# EAGLE design ASD2205 (EAGLE 9.6.2)
DATABASE: ./../../../../../Components/TinyCircuits_Part_Database.txt
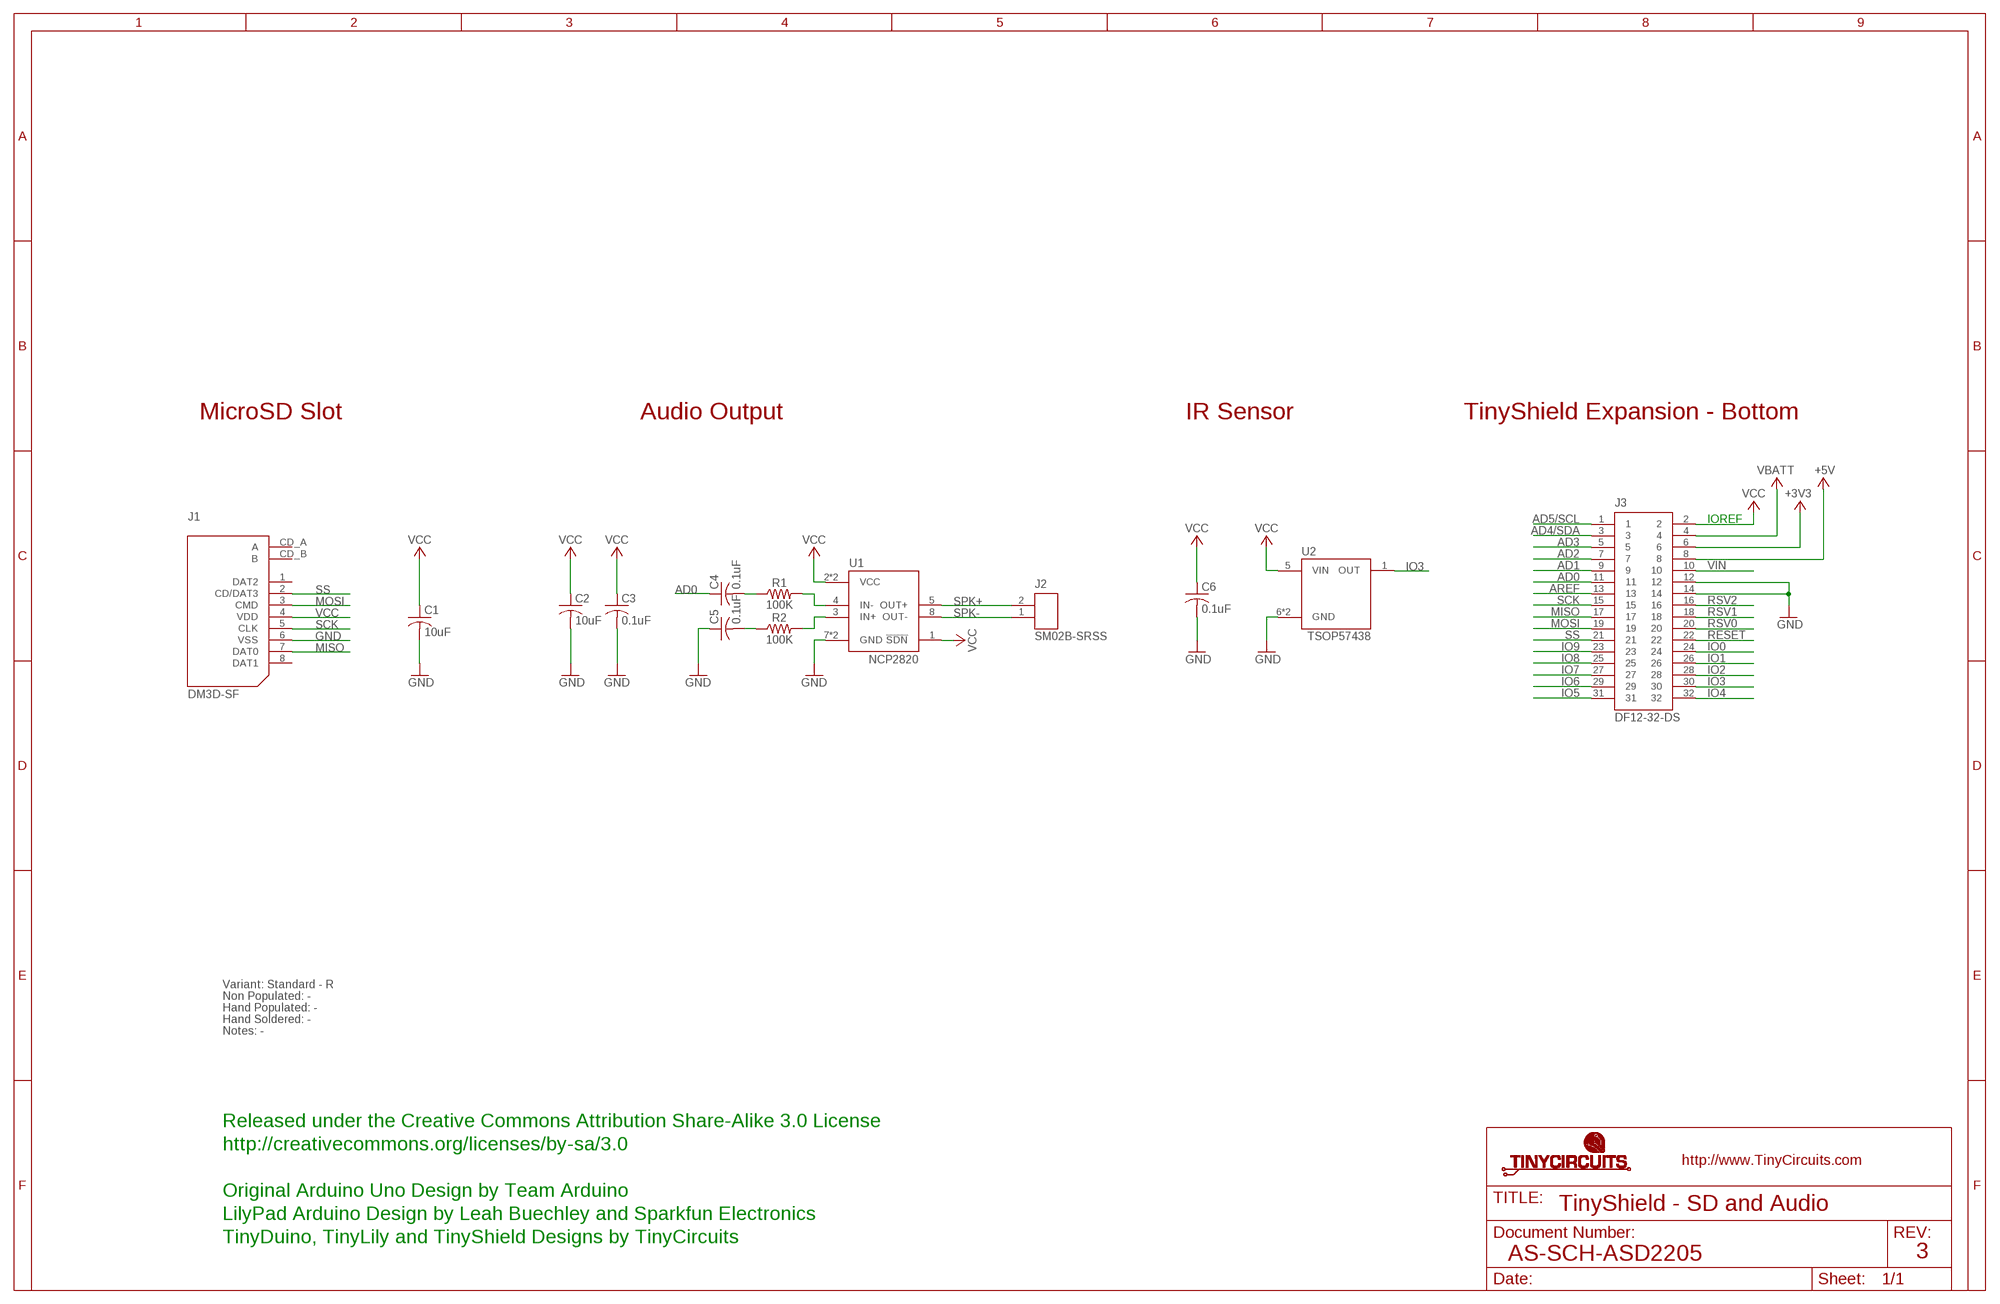
[diagram p0: schematic, sheet 1]

## Parts
C1  10uF  AS-ITM-00002  [C0603]
C2  10uF  AS-ITM-00002  [C0603]
C3  0.1uF  AS-ITM-00008  [C0402]
C4  0.1uF  AS-ITM-00008  [C0402]
C5  0.1uF  AS-ITM-00008  [C0402]
C6  0.1uF  AS-ITM-00008  [C0402]
J1  DM3D-SF  AS-ITM-00047  [SD_CARD]
J2  SM02B-SRSS  AS-ITM-00231  [JST_SH_2X1]
J3  DF12-32-DS  AS-ITM-00012  [DF12-32-DS]
R1  100K  AS-ITM-00004  [0402]
R2  100K  AS-ITM-00004  [0402]
U1  NCP2820  AS-ITM-00370  [WSON-8]
U2  TSOP57438  AS-ITM-00360  [TSOP57]

## Nets
+3V3: J3.6
+5V: J3.8
AD0: C4.1 J3.11
AD1: J3.9
AD2: J3.7
AD3: J3.5
AD4/SDA: J3.3
AD5/SCL: J3.1
AREF: J3.13
GND: C1.2 C2.2 C3.2 C5.1 C6.2 J1.6(VSS) J3.12 J3.14 U1.7(GND) U1.9(GND) U2.6(GND) U2.8(GND)
IO0: J3.24
IO1: J3.26
IO2: J3.28
IO3: J3.30 U2.1(OUT)
IO4: J3.32
IO5: J3.31
IO6: J3.29
IO7: J3.27
IO8: J3.25
IO9: J3.23
MISO: J1.7(DAT0) J3.17
MOSI: J1.3(CMD) J3.19
N$3: R1.2 U1.4(IN-)
N$4: R2.2 U1.3(IN+)
N$11: C4.2 R1.1
N$12: C5.2 R2.1
RESET: J3.22
RSV0: J3.20
RSV1: J3.18
RSV2: J3.16
SCK: J1.5(CLK) J3.15
SPK+: J2.2 U1.5(OUT+)
SPK-: J2.1 U1.8(OUT-)
SS: J1.2(CD/DAT3) J3.21
VBATT: J3.4
VCC: C1.1 C2.1 C3.1 C6.1 J1.4(VDD) J3.2 U1.1(!SDN) U1.2(VCC) U1.6(VCC) U2.5(VIN)
VIN: J3.10
Unconnected: J1.1(DAT2) J1.8(DAT1) J1.CD_A(A) J1.CD_B(B)

## Notes on the sheet
- MicroSD Slot | Audio Output | IR Sensor | TinyShield Expansion - Bottom
- IOREF
- Variant: Standard - R
- Non Populated: -
- Hand Populated: -
- Hand Soldered: -
- Notes: -
- Released under the Creative Commons Attribution Share-Alike 3.0 License
- http://creativecommons.org/licenses/by-sa/3.0
- Original Arduino Uno Design by Team Arduino
- TinyShield - SD and Audio
- LilyPad Arduino Design by Leah Buechley and Sparkfun Electronics
- TinyDuino, TinyLily and TinyShield Designs by TinyCircuits
- AS-SCH-ASD2205 | 3

## Library data of the parts
C1 C2 = tinycircuits:AS-ITM-00002: CAP CER 10UF 10V 20% X5R 0603; PARTNO: AS-ITM-00002
C3-C6 = tinycircuits:AS-ITM-00008: CAP CER 0.1UF 16V 10% X5R 0402; PARTNO: AS-ITM-00008
J1 = tinycircuits:AS-ITM-00047: CONN MICRO SD R/A PUSH-PULL SMD; PARTNO: AS-ITM-00047; PNPROTATION: 270
J2 = tinycircuits:AS-ITM-00231: CONN HEADER SH 2POS SIDE 1MM; PARTNO: AS-ITM-00231; PNPROTATION: 180; VALUE: SM02B-SRSS-TB(LF)(SN)
J3 = tinycircuits:AS-ITM-00012: CONN RECEPT 32POS 3MM SMD 0.5MM; PARTNO: AS-ITM-00012; PNPROTATION: 0
R1 R2 = tinycircuits:AS-ITM-00004: RES 100K OHM 1/16W 1% 0402; PARTNO: AS-ITM-00004
U1 = tinycircuits:AS-ITM-00370: IC PWR AMP AUD 2.65W D 8UDFN; PARTNO: AS-ITM-00370; PNPROTATION: 90
U2 = tinycircuits:AS-ITM-00360: IC IR RCVR MOD 38KHZ; PARTNO: AS-ITM-00360

## Board
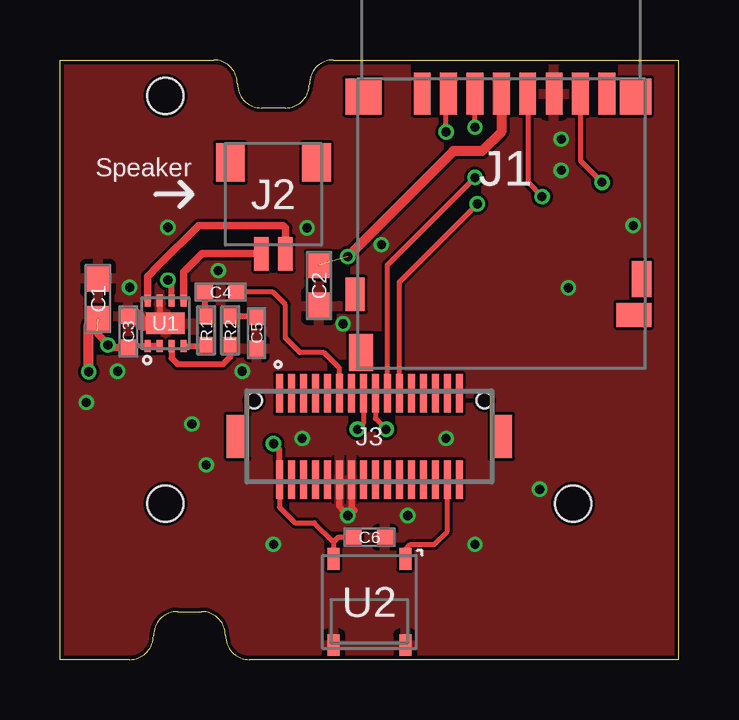
[diagram p1: board, top side]
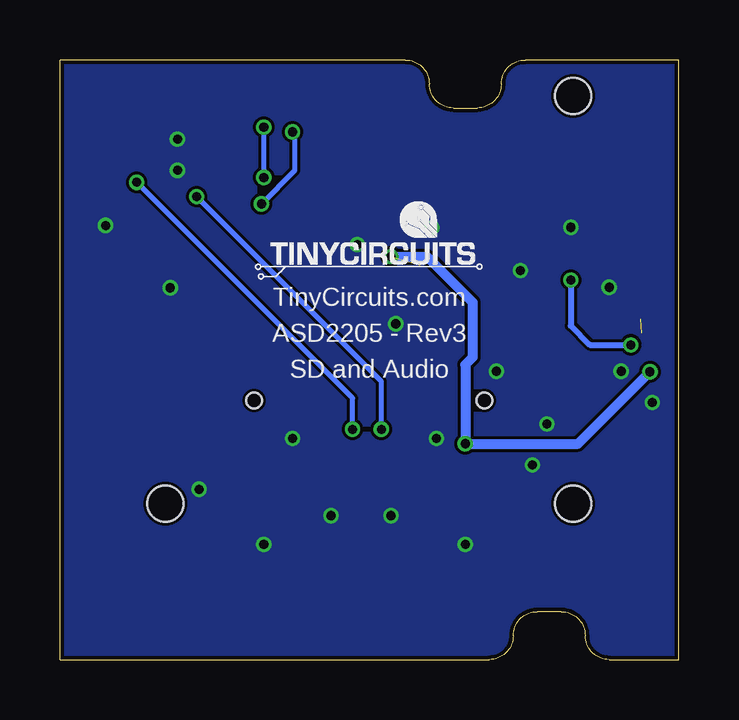
[diagram p2: board, bottom side, seen from below]

Size 25.8 x 25 mm. Coordinates in mm from the lower left corner, seen from the top.
Outline: 0,25 6.4,25 arc-90 7.4,24 arc90 8.4,23 9.4,23 arc90 10.4,24 arc-90 11.4,25 25.8,25 25.8,0 7.9,0 arc-90 6.9,1 arc90 5.9,2 4.9,2 arc90 3.9,1 arc-90 2.9,0 0,0 0,25
Copper layers (1*16): Top 0.035mm / dielectric 1.5mm / Bottom 0.035mm
Design rules "default *": minimum track width 8mil, minimum drill 15mil, track to track 5mil, track to pad 5mil, pad to pad 5mil, via to via 6mil, smd to smd 5mil, copper to edge 6mil, drill to drill 8mil, minimum pad ring 10mil, minimum via ring 5mil, stop-mask expansion 4mil, vias tented up to drill 25mil, thermal gap 10mil
Holes 1.5 mm at 4.4,23.5 21.4,6.5 4.4,6.5

### Footprints (pad centres in the part's own frame; a part is rotated, then mirrored left to right if it is on the bottom)
C0603 = smd 1.1 x 1: 1 -0.85,0; 2 0.85,0
C0402 = smd 0.65 x 0.6: 1 -0.65,0; 2 0.65,0
SD_CARD = smd 0.7 x 1.75: 1 3.3,0; 2 2.2,0; 3 1.1,0; 4 0,0; 5 -1.1,0; 6 -2.2,0; 7 -3.3,0; 8 -4.4,0 | smd 1.3 x 1.5: 9 -5.6,0.125 | smd 1.5 x 1.5: 10 5.75,0.125 | smd 0.8 x 1.5: 11 -5.85,7.725 | smd 0.8 x 1.4: 13 6.1,8.375 | smd 1 x 1.55: CD_A 5.85,10.8 | smd 1.45 x 1: CD_B -5.525,9.225
JST_SH_2X1 = smd 0.6 x 1.4: 1 -0.5,2.475; 2 0.5,2.475 | smd 1.2 x 1.6: PAD1 -1.8,-1.325; PAD2 1.8,-1.325
DF12-32-DS = smd 0.3 x 1.6: 1 -3.75,1.8; 2 -3.75,-1.8; 3 -3.25,1.8; 4 -3.25,-1.8; 5 -2.75,1.8; 6 -2.75,-1.8; 7 -2.25,1.8; 8 -2.25,-1.8; 9 -1.75,1.8; 10 -1.75,-1.8; 11 -1.25,1.8; 12 -1.25,-1.8; 13 -0.75,1.8; 14 -0.75,-1.8; 15 -0.25,1.8; 16 -0.25,-1.8; 17 0.25,1.8; 18 0.25,-1.8; 19 0.75,1.8; 20 0.75,-1.8; 21 1.25,1.8; 22 1.25,-1.8; 23 1.75,1.8; 24 1.75,-1.8; 25 2.25,1.8; 26 2.25,-1.8; 27 2.75,1.8; 28 2.75,-1.8; 29 3.25,1.8; 30 3.25,-1.8; 31 3.75,1.8; 32 3.75,-1.8 | smd 0.9 x 1.8: F1 -5.5,0; F2 5.5,0 | hole 0.65: -4.8,1.5; 4.8,1.5
0402 = smd 0.65 x 0.55: 1 -0.6,0; 2 0.6,0
WSON-8 = smd 0.25 x 0.5: 1 -0.75,-0.95; 2 -0.25,-0.95; 3 0.25,-0.95; 4 0.75,-0.95; 5 0.75,0.95; 6 0.25,0.95; 7 -0.25,0.95; 8 -0.75,0.95 | smd 1.6 x 0.9: 9 0,0
TSOP57 = smd 0.5 x 0.9: 1 -1.5,-1.8; 5 1.5,-1.8; 6 1.5,1.8; 8 -1.5,1.8

### Placement (x,y rotation side)
C1  1.59,15.05 90 top
C2  10.8,15.6 270 top
C3  2.85,13.67 90 top
C4  6.7,15.32 180 top
C5  8.2,13.62 90 top
C6  12.9,5.1 0 top
J1  18.4,23.6 180 top
J2  8.9,19.4 180 top
J3  12.9,9.3 0 top
R1  6.1,13.72 270 top
R2  7.1,13.72 270 top
U1  4.4,14.02 0 top
U2  12.9,2.4 180 top
U$1  [DOCFIELD-TINYCIRCUITS-PCB]  36.81,-5 0 top  (outside the outline)

### Tracks (layer width: path | path; a pad name or v marks a point on that pad's centre or on a via)
AD0
  Top 0.203: J3.11 11.65,12.15 11,12.8 10,12.8 9.4,13.4 9.4,14.8 8.88,15.32 C4.1
GND  (via drill 0.38)
  Top 0.254: J3.14 12.15,6.35 12.3,6.2 11.8,6.2 11.65,6.4 11.65,7.4 11.7,7.5 11.8,7.4 | U1.7 4.15,14.27 U1.9
  Top 0.61: C3.2 3.15,14.32 3.45,14.02 U1.9
  other vias: 20.9,21.7 12,6 23.9,18.1 21.2,15.5 20,7.1 11.8,14 13.4,17.3 14.5,6 17.3,4.8 8.9,4.8 20.9,20.4 6.6,16.22 7.6,12.02 2.4,12.02 10.3,18 2.9,15.52 4.5,18.02 1.1,10.72 5.5,9.82 6.1,8.12 10.1,9.22 16.1,9.22
  pour Top: 0,25 25.8,25 25.8,0 0,0
  pour Bottom: 0,25 25.8,25 25.8,0 0,0
IO3
  Top 0.203: U2.1 14.4,4.6 14.6,4.8 15.6,4.8 16.15,5.35 J3.30
MISO  (via drill 0.38)
  Top 0.203: J3.17 13.15,10.05 v13.6,9.6 | J1.7 21.7,20.8 v22.6,19.9
  Bottom 0.203: v22.6,19.9 13.6,10.9 v13.6,9.6
MOSI  (via drill 0.38)
  Top 0.203: J3.19 13.65,16.45 v17.3,20.1 | v17.3,22.2 J1.3
  Bottom 0.203: v17.3,20.1 v17.3,22.2
N$3
  Top 0.254: U1.4 5.95,13.07 R1.2
N$4
  Top 0.254: U1.3 4.65,12.57 4.9,12.32 6.8,12.32 7.1,12.62 R2.2
N$11
  Top 0.254: R1.1 6.05,14.32 C4.2
N$12
  Top 0.254: R2.1 7.95,14.32 C5.2
SCK  (via drill 0.38)
  Top 0.203: v12.4,9.6 12.65,9.85 J3.15 | J1.5 19.5,19.9 v20.1,19.3
  Bottom 0.203: v20.1,19.3 12.4,11.6 v12.4,9.6
SPK+
  Top 0.305: U1.5 5.15,15.47 5.15,16.15 5.92,16.93 J2.2
SPK-
  Top 0.305: U1.8 3.65,15.97 4.1,16.42 5.78,18.1 9.3,18.1 9.4,18 J2.1
SS  (via drill 0.38)
  Top 0.203: J3.21 14.15,15.75 v17.4,19 | v16.1,22 16.1,23.5 J1.2
  Bottom 0.203: v17.4,19 16,20.4 16,21.9 v16.1,22
VCC  (via drill 0.38)  (2 unrouted)
  Top 0.203: J3.2 9.15,6.35 9.8,5.7 10.6,5.7 11.4,4.9 | 11.4,4.9 U2.5 | C6.1 11.6,5.1 11.4,4.9 | U1.1 2.85,13.07 C3.1
  Top 0.254: J3.2 9.15,8.75 v8.9,9 | U1.2 U1.1 | U1.6 4.65,15.67 v4.5,15.82
  Top 0.305: 2.8,13.07 C3.1 2.1,13.02 v2,13.12 1.55,13.62
  Top 0.406: J1.4 18.4,22 17.6,21.2 16.4,21.2 v12,16.8 | v1.2,12 1.2,13.96 1.44,14.2 C1.1
  Bottom 0.254: v4.5,15.82 4.5,13.92 3.7,13.12 v2,13.12
  Bottom 0.406: v12,16.8 10.5,16.8 8.6,14.9 8.6,12.6 8.9,12.3 v8.9,9 4.2,9 v1.2,12

### Text on the board
tPlace: Speaker
bPlace: TinyCircuits.com | ASD2205 - Rev3 | SD and Audio
Document: FABRICATION DRAWING | NOTES: | 1. PRINTED CIRCUIT BOARD MADE FROM NEMA GRADE FR-4 EPOXY LAMINATE | WITH 1 OUNCE COPPER PLATING AND .024 THICKNESS. | 2. ALL DIMENSIONS ARE GIVEN IN INCHES. | 3. CIRCUIT PATHS ARE FOR REFERENCE ONLY. | 4. HOLE SIZES SHOWN ARE FINISHED DIAMETERS AFTER PLATING. | 5. BOARD PLATED USING REFLOW OR SIMILAR METHOD. | 6. BOARD TO HAVE BLUE SOLDER MASK ON PLATED SURFACES USING WET FILM | 7. SILKSCREEN BOARD USING WHITE INK. | SR100 OR SR1010 EPOXY. EQUIVALENT WET OR DRY FILM MAY BE USED. | 8. THE FOLLOWING INFORMATION APPLIES TO THIS BOARD: | * 2 COPPER LAYERS | * .024 BOARD THICKNESS | * REQUIRES TOP SIDE SILKSCREEN | Released under the Creative Commons Attribution Share-Alike 3.0 License | http://creativecommons.org/licenses/by-sa/3.0 | Original Arduino Uno Design by Team Arduino | LilyPad Arduino Design by Leah Buechley and Sparkfun Electronics | TinyDuino, TinyLily and TinyShield Designs by TinyCircuits | TinyShield - SD and Audio | AS-PCB-ASD2205 | 3